# Altium schematic sheet [18]-WIFI_MODULE.SchDoc
size A4
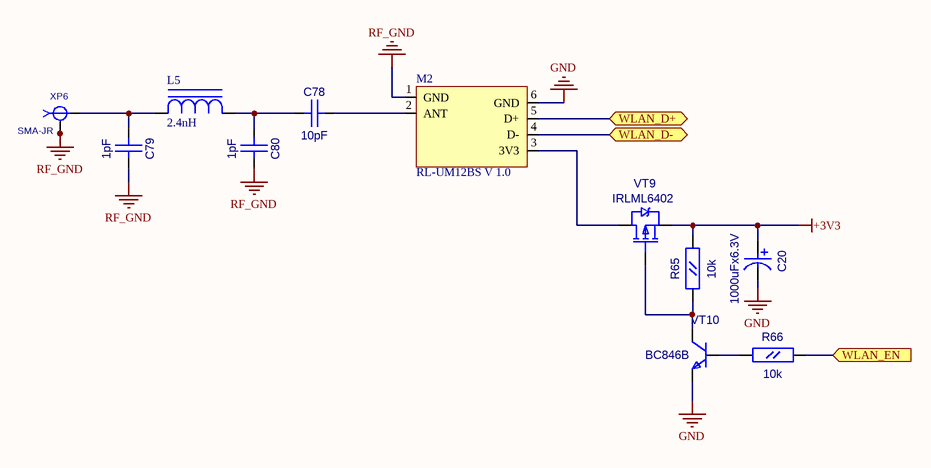
[diagram p0: [18]-WIFI_MODULE.SchDoc]

## Parts
C20  1000uFx6.3V  [CC8X3.5]
C78  10pF  [CC0603]
C79  1pF  [CC0603]
C80  1pF  [CC0603]
L5  2.4nH  [L0402]
M2  RL-UM12BS V 1.0  [RTL8188_MODULE]
R65  10k  [RC0603]
R66  10k  [RC0603]
VT9  IRLML6402  [SOT-23(123)]
VT10  BC846B  [SOT-23(123)]
XP6  SMA-JR  [SMA-JR]

## Ports
WLAN_D+ (bidir), WLAN_D- (bidir), WLAN_EN (in)

## Nets
+3V3: C20.1 R65.2(B) VT9.2(S)
GND: C20.2 M2.6(GND) VT10.2(E)
RF_GND: C79.2(B) C80.2(B) M2.1(GND) XP6.2 XP6.3 XP6.4 XP6.5
WLAN_D+: M2.5(D+) ; port WLAN_D+
WLAN_D-: M2.4(D-) ; port WLAN_D-
WLAN_EN: R66.2(B) ; port WLAN_EN
NetC78_1: C78.1(A) C80.1(A) L5.2(C)
NetC78_2: C78.2(B) M2.2(ANT)
NetC79_1: C79.1(A) L5.1(A) XP6.1
NetM2_3: M2.3(3V3) VT9.3(D)
NetR65_1: R65.1(A) VT9.1(G) VT10.3(C)
NetR66_1: R66.1(A) VT10.1(B)

## Library data of the parts
C20 = CAP_8mm: Radial capacitor; Value: 1000uFx6.3V
C78-C80 = CC0603
  C78: Value: 10pF
  C79 C80: Value: 1pF
L5 = L0402: Value: 2.4nH
M2 = RTL8188_MODULE: Value: RL-UM12BS V 1.0
R65 R66 = RC0603: Value: 10k
VT9 = IRLML6402: HEXFET Power MOSFET; OriginalName: IRLML5103; ComponentField7: Published 8-Jun-2000; Value: IRLML6402
VT10 = BC846BLT1: ComponentField7: Published 29-Sep-2000; OriginalName: BC846BLT1; Value: BC846B
XP6 = SMA-JR: Value: SMA-JR